# Altium schematic sheet PMIC.SchDoc: PMIC
size A4; Organization: Gateway; Address1: University of Colorado; Address2: Boulder; DocumentNumber: 2; Revision: 1; SheetNumber: 2; SheetTotal: 6
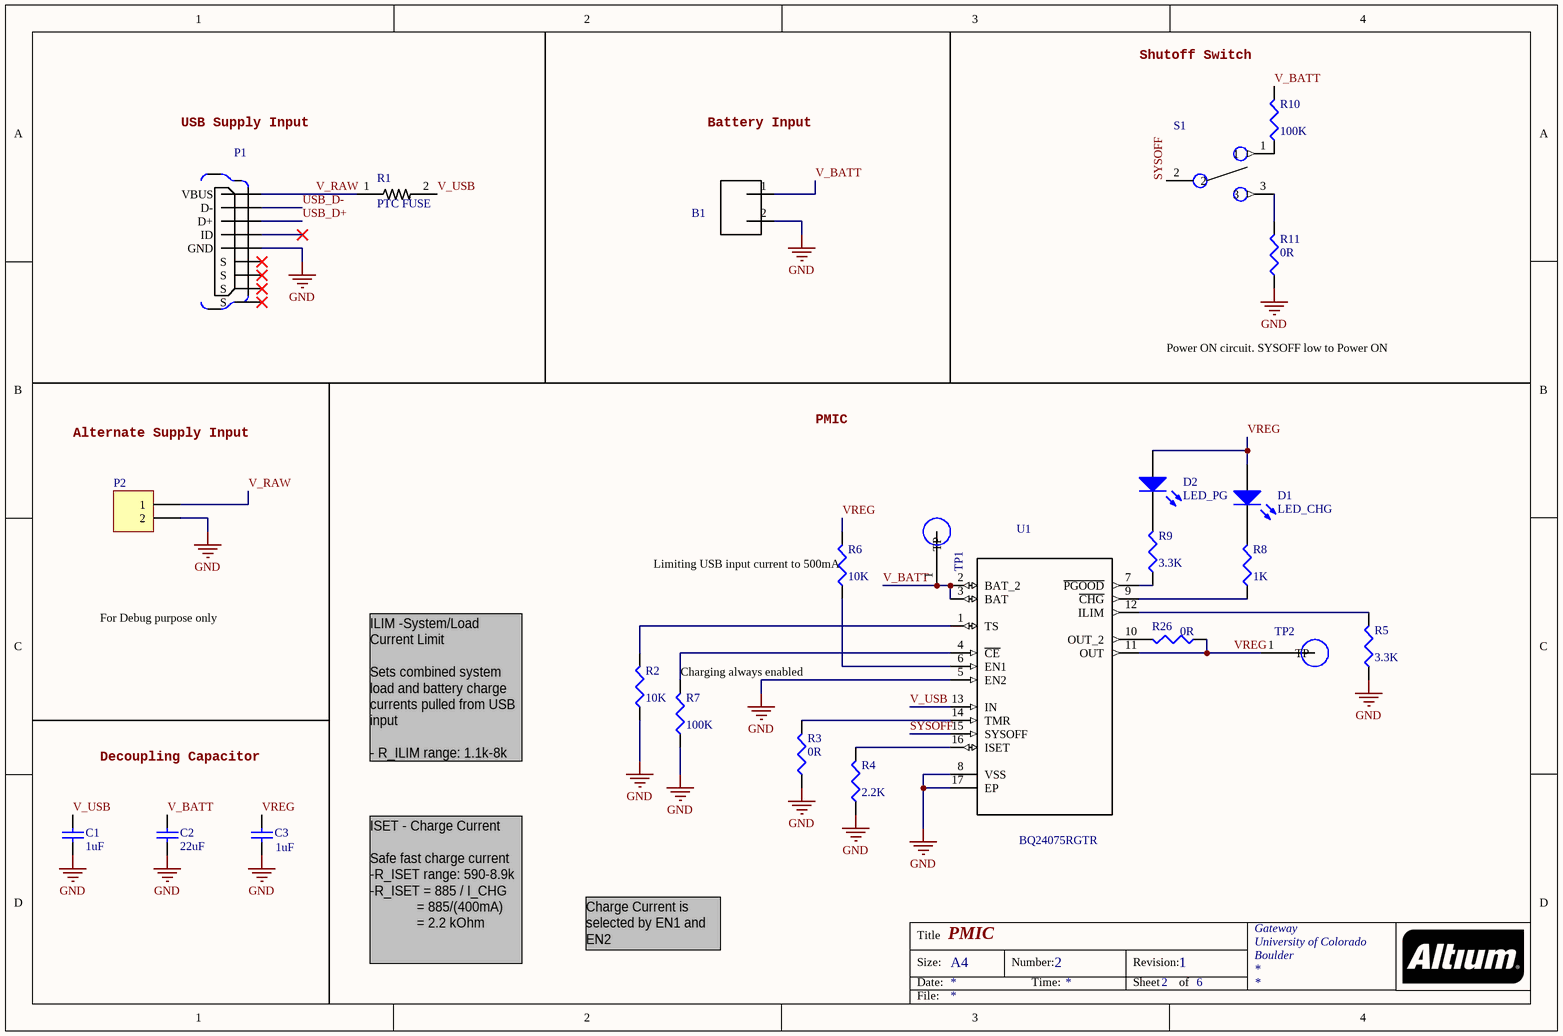
[diagram p0: PMIC.SchDoc]

## Parts
B1  VBATT  [S2B-PH-SM4-TB(LF)(SN)]  (value not drawn)
C1  value 1uF  [1608[0603]]  (hidden comment: CL10B105KP8NNNC)
C2  value 22uF  [1608[0603]]  (hidden comment: CL10A226MPCNUBE)
C3  value 1uF  [1608[0603]]  (hidden comment: CL10B105KP8NNNC)
D1  LED_CHG  [1608[0603]]
D2  LED_PG  [1608[0603]]
P1  10104111-0001LF  [FRAMATOME_10104111-0001LF]  (value not drawn)
P2  (no value)  [HDR1X2]
R1  PTC FUSE  [RESC3216X125N]
R2  value 10K  [1608[0603]]  (hidden comment: MCT06030C1002FP500)
R3  value 0R  [1608[0603]]  (hidden comment: MCT0603MZ0000ZP500)
R4  value 2.2K  [1608[0603]]  (hidden comment: ERJ-3EKF2201V)
R5  value 3.3K  [1608[0603]]  (hidden comment: ERJ-3GEYJ332V)
R6  value 10K  [1608[0603]]  (hidden comment: MCT06030C1002FP500)
R7  value 100K  [1608[0603]]  (hidden comment: RG1608P-104-B-T5)
R8  value 1K  [1608[0603]]  (hidden comment: MCT06030C1001FP500)
R9  value 3.3K  [1608[0603]]  (hidden comment: ERJ-3GEYJ332V)
R10  value 100K  [1608[0603]]  (hidden comment: RG1608P-104-B-T5)
R11  value 0R  [1608[0603]]  (hidden comment: MCT0603MZ0000ZP500)
R26  value 0R  [1608[0603]]  (hidden comment: MCT0603MZ0000ZP500)
S1  AYZ0102AGRLC  [SW_AYZ0102AGRLC]  (value not drawn)
TP1  VBATT_TP  [TP380X203]  (value not drawn)
TP2  VREG_TP  [TP380X203]  (value not drawn)
U1  BQ24075RGTR  [QFN50P300X300X100-17N]

## Nets
GND: B1.2 C1.1 C2.2 C3.1 P1.5(GND) P2.2 R2.1 R3.1 R4.1 R5.1 R7.1 R11.1 U1.5(EN2) U1.8(VSS) U1.17(EP)
SYSOFF: S1.2 U1.15(SYSOFF)
USB_D+: P1.3(D+)
USB_D-: P1.2(D-)
V_BATT: B1.1 C2.1 R10.2 TP1.1(TP) U1.2(BAT_2) U1.3(BAT)
V_RAW: P1.1(VBUS) P2.1 R1.1
V_USB: C1.2 R1.2 U1.13(IN)
VREG: C3.2 D1.1(A) D2.1(A) R6.2 R26.1 TP2.1(TP) U1.11(OUT)
NetD1_2: D1.2(K) R8.2
NetD2_2: D2.2(K) R9.2
NetR2_2: R2.2 U1.1(TS)
NetR3_2: R3.2 U1.14(TMR)
NetR4_2: R4.2 U1.16(ISET)
NetR5_2: R5.2 U1.12(ILIM)
NetR6_1: R6.1 U1.6(EN1)
NetR7_2: R7.2 U1.4(~{CE})
NetR8_1: R8.1 U1.9(~{CHG})
NetR9_1: R9.1 U1.7(~{PGOOD})
NetR10_1: R10.1 S1.1
NetR11_2: R11.2 S1.3
NetR26_2: R26.2 U1.10(OUT_2)

Not connected (* = marked no-connect by the designer): P1 4(ID)* 6(S)* 7(S)* 8(S)* 9(S)*

## Notes on the sheet
- Shutoff Switch
- USB Supply Input
- Battery Input
- Power ON circuit. SYSOFF low to Power ON
- Alternate Supply Input
- PMIC
- (near R6) Limiting USB input current to 500mA
- For Debug purpose only
- (near R7) Charging always enabled
- Decoupling Capacitor
- ILIM -System/Load Current Limit
  Sets combined system load and battery charge currents pulled from USB input
  - R_ILIM range: 1.1k-8k
  - R_ILIM= 1650 / I_INMAX
  = 1650 / 0.5
  = 3.3 kOhm
- ISET - Charge Current
  Safe fast charge current
  -R_ISET range: 590-8.9k
  -R_ISET = 885 / I_CHG
  = 885/(400mA)
  = 2.2 kOhm
- Charge Current is selected by EN1 and EN2
- Title
- Size:
- Date:
- A4
- Number:
- Time:
- Revision:
- Sheet
- of
- File:

## Library data of the parts
B1 = S2B-PH-SM4-TB(LF)(SN): CONN HEADER PH SIDE 2POS 2MM SMD; Manufacturer: JST Sales America Inc.; Digi-Key Part Number: 455-1749-1-ND; Manufacturer Part Number: S2B-PH-SM4-TB(LF)(SN); ComponentLink1URL: https://www.digikey.com/products/en/connectors-interconnects/rectangular-connectors-headers-male-pins/314?k=S2B-PH-SM4-TB%28LF%29%28SN%29&k=&pkeyword=S2B-PH-SM4-TB%28LF%29%28SN%29&pv7=2&sf=0&quantity=&ColumnSort=0&page=1&pageSize=25; ComponentLink1Description: Digi-Key URL
C1 C3 = Cap Semi: CAP CER 1UF 10V X7R 0603; Manufacturer: Samsung Electro-Mechanics; Digi-Key Part Number: 1276-1946-1-ND; Manufacturer Part Number: CL10B105KP8NNNC; ComponentLink1URL: https://www.digikey.com/product-detail/en/samsung-electro-mechanics/CL10B105KP8NNNC/1276-1946-1-ND/3890032; ComponentLink1Description: Digi-Key Link
C2 = Cap: CAP CER 22UF 10V X5R 0603; Manufacturer: Samsung Electro-Mechanics; Published: 8-Jun-2000; LatestRevisionDate: 17-Jul-2002; LatestRevisionNote: Re-released for DXP Platform.; PackageReference: RAD-0.3; Publisher: Altium Limited; PackageDescription: Radial Cap, Thru-Hole; 2 Leads; 0.3 in Pin Spacing; Manufacturer Part Number: CL10A226MPCNUBE; Digi-Key Part Number: 1276-6504-1-ND; ComponentLink1URL: https://www.digikey.com/product-detail/en/samsung-electro-mechanics/CL10A226MPCNUBE/1276-6504-1-ND/5961363; ComponentLink1Description: Digi-Key Link
D1 = LED2: Blue 470nm LED Indication - Discrete 2.85V 0603 (1608 Metric); Manufacturer: OSRAM Opto Semiconductors Inc.; Manufacturer Part Number: LB Q39G-L2OO-35-1; Digi-Key Part Number: 475-2816-1-ND; ComponentLink1URL: https://www.digikey.com/product-detail/en/osram-opto-semiconductors-inc/LB-Q39G-L2OO-35-1/475-2816-1-ND/2176355; ComponentLink1Description: Digi-Key Link
D2 = LED2: LED GREEN DIFFUSED 0603 SMD; Manufacturer: OSRAM Opto Semiconductors Inc.; Manufacturer Part Number: LG L29K-F2J1-24-Z; Digi-Key Part Number: 475-3118-1-ND; ComponentLink1URL: https://www.digikey.com/product-detail/en/osram-opto-semiconductors-inc/LG-L29K-F2J1-24-Z/475-3118-1-ND/4899549; ComponentLink1Description: Digi-Key Link
P1 = 10104111-0001LF: Micro Usb, 2.0 Type Ab, Receptacle, Th; Manufacturer: Amphenol FCI; Digi-Key Part Number: 609-4053-1-ND; ComponentLink1URL: https://www.digikey.com/product-detail/en/amphenol-fci/10104111-0001LF/609-4053-1-ND/2350359?utm_source=snapeda&utm_medium=aggregator&utm_campaign=symbol; Manufacturer Part Number: 10104111-0001LF; Value: *; ComponentLink1Description: Digi-Key Link
P2 = Header 2: Header, 2-Pin
R1 = 0ZCA0075FF2G: PTC RESET FUSE 6V 500MA 1206; Manufacturer: Bel Fuse; Manufacturer Part Number: Littelfuse Inc.; Package: 1206 Bel Fuse; Availability: Available; MP: 0ZCA0075FF2G; Price: None; SnapEDA_Link: https://www.snapeda.com/parts/0ZCA0075FF2G/Bel%20Fuse%20Inc./view-part/?ref=snap; Value: *; ComponentLink1URL: https://www.digikey.com/product-detail/en/littelfuse-inc/1206L050YR/F2112CT-ND/455721; ComponentLink1Description: Digi-Key Link; Digi-Key Part Number: F2112CT-ND
R2 R6 = Res3: RES SMD 10K OHM 1% 1/8W 0603; Manufacturer: Vishay Beyschlag; Digi-Key Part Number: MCT0603-10.0K-CFCT-ND; ComponentLink1URL: https://www.digikey.com/products/en?keywords=MCT0603-10.0K-CFCT-ND; ComponentLink1Description: Digi-Key URL; Manufacturer Part Number: MCT06030C1002FP500
R3 R11 R26 = Res3: RES 0 OHM JUMPER 1/8W 0603; Manufacturer: Vishay Beyschlag; Published: 8-Jun-2000; LatestRevisionDate: 29-May-2009; LatestRevisionNote: IPC-7351 Footprint Added.; PackageReference: J1-0603; Publisher: Altium Limited; PackageDescription: Chip Resistor; Digi-Key Part Number: 749-1745-1-ND; Manufacturer Part Number: MCT0603MZ0000ZP500; ComponentLink1URL: https://www.digikey.com/product-detail/en/vishay-beyschlag/MCT0603MZ0000ZP500/749-1745-1-ND/7348053
  R3 R26: ComponentLink1Description: Digi-Key Link
  R11: ComponentLink2Description: Digi-Key Link
R4 = Res3: RES SMD 2.2K OHM 1% 1/10W 0603; Manufacturer: Panasonic Electronic Components; Digi-Key Part Number: P2.20KHCT-ND; ComponentLink1URL: https://www.digikey.com/product-detail/en/panasonic-electronic-components/ERJ-3EKF2201V/P2.20KHCT-ND/1746742; ComponentLink1Description: Digi-Key URL; Manufacturer Part Number: ERJ-3EKF2201V
R5 R9 = Res3: RES SMD 3.3K OHM 5% 1/10W 0603; Manufacturer: Panasonic Electronic Components; Digi-Key Part Number: P3.3KGCT-ND; ComponentLink1URL: https://www.digikey.com/product-detail/en/panasonic-electronic-components/ERJ-3GEYJ332V/P3.3KGCT-ND/135146; ComponentLink1Description: Digi-Key URL; Manufacturer Part Number: ERJ-3GEYJ332V
R7 R10 = Res3: RES SMD 100K OHM 0.1% 1/10W 0603; Manufacturer: Susumu; Digi-Key Part Number: RG16P100KBCT-ND; ComponentLink1URL: https://www.digikey.com/products/en?keywords=RG16p100kbct-nd; ComponentLink1Description: Digi-Key URL; Manufacturer Part Number: RG1608P-104-B-T5
R8 = Res3: RES SMD 1K OHM 1% 1/8W 0603; Manufacturer: Vishay Beyschlag; Digi-Key Part Number: MCT0603-1.00K-CFCT-ND; ComponentLink1URL: https://www.digikey.com/product-detail/en/vishay-beyschlag/MCT06030C1001FP500/MCT0603-1.00K-CFCT-ND/2607875; ComponentLink1Description: Digi-Key URL; Manufacturer Part Number: MCT06030C1001FP500
S1 = AYZ0102AGRLC: SWITCH SLIDE SPDT 100MA 12V; Manufacturer: C&K; Digi-Key Part Number: 401-2012-1-ND; Manufacturer Part Number: AYZ0102AGRLC; ComponentLink1URL: https://www.digikey.com/products/en/switches/slide-switches/213?k=AYZ0102AGRLC&k=&pkeyword=AYZ0102AGRLC&pv7=2&sf=0&quantity=&ColumnSort=0&page=1&pageSize=25; ComponentLink1Description: Digi-Key Link
TP1 TP2 = 5019: PC TEST POINT MINIATURE; Manufacturer: Keystone Electronics; MF: Keystone; MP: 5019; Package: 2010 Keystone; Digi-Key_Part_Number: 36-5019CT-ND; ComponentLink1URL: https://www.digikey.com/product-detail/en/keystone-electronics/5019/36-5019CT-ND/3907344?utm_source=snapeda&utm_medium=aggregator&utm_campaign=symbol; SnapEDA_Link: https://www.snapeda.com/parts/5019/Keystone%20Electronics/view-part/?ref=snap; Value: *; ComponentLink1Description: Digi-Key Link; Manufacturer Part Number: 5019; Digi-Key Part Number: 36-5019CT-ND
U1 = BQ24075RGTT: IC LI-ION CHARGE MGMT 16-QFN; Manufacturer: Texas Instruments; SnapEDA_Link: https://www.snapeda.com/parts/BQ24075RGTT/Texas%20Instruments/view-part/?ref=snap; Manufacturer Part Number: BQ24075RGTT; Availability: Available; Package: QFN-16 Texas Instruments; Price: None; Value: *; Digi-Key Part Number: 296-38874-1-ND; ComponentLink1URL: https://www.digikey.com/product-detail/en/texas-instruments/BQ24075RGTR/296-38874-1-ND/5142986; ComponentLink1Description: Digi Key Link